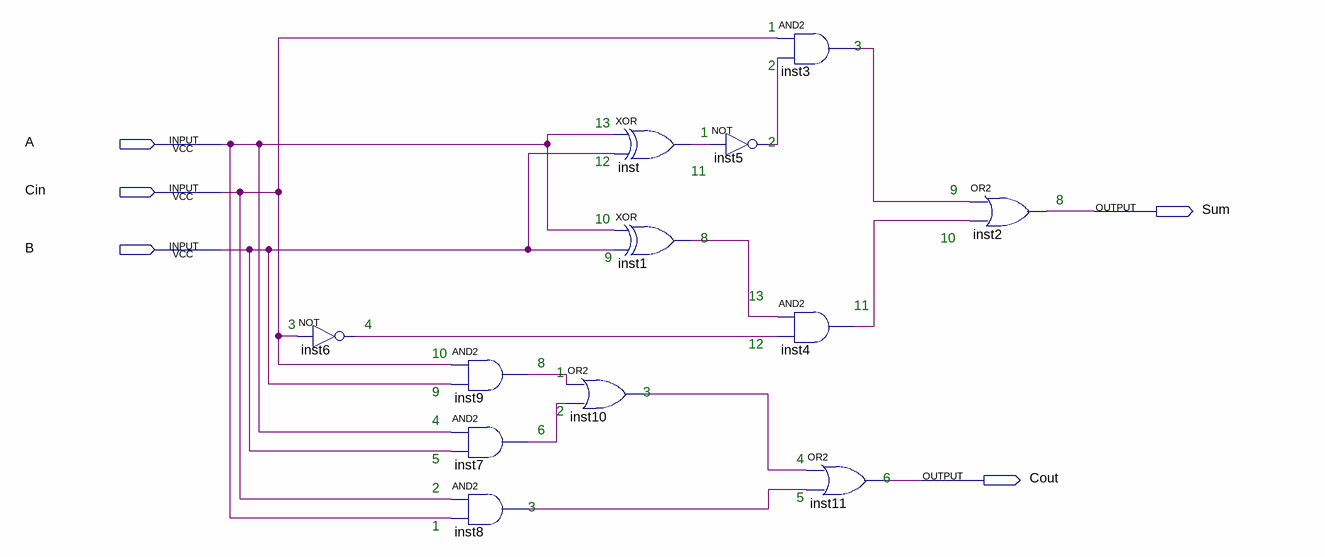
[diagram p0: schematic sheet]
// Quartus schematic ex6.bdf as structural Verilog: 12 symbols, 5 pins
module ex6 (
  input  A,
  input  Cin,
  input  B,
  output Sum,
  output Cout
);

  wire inst1_out, inst3_out, inst4_out, inst5_out, inst6_out, inst7_out, inst8_out, inst9_out, inst10_out,
       inst_out;

  not inst6 (inst6_out, Cin);
  and inst9 (inst9_out, Cin, B);
  and inst7 (inst7_out, A, B);
  and inst8 (inst8_out, Cin, A);
  xor inst (inst_out, A, B);
  xor inst1 (inst1_out, A, B);
  or inst10 (inst10_out, inst9_out, inst7_out);
  and inst3 (inst3_out, Cin, inst5_out);
  not inst5 (inst5_out, inst_out);
  and inst4 (inst4_out, inst1_out, inst6_out);
  or inst11 (Cout, inst10_out, inst8_out);
  or inst2 (Sum, inst3_out, inst4_out);

  // Notes on the sheet:
  //   1
  //   3
  //   2
  //   13
  //   1
  //   2
  //   12
  //   11
  //   9
  //   8
  //   10
  //   8
  //   10
  //   9
  //   13
  //   11
  //   3
  //   4
  //   12
  //   10
  //   8
  //   1
  //   9
  //   3
  //   2
  //   4
  //   6
  //   5
  //   4
  //   6
  //   2
  //   5
  //   3
  //   1
endmodule
